# EAGLE design lda (EAGLE 8.2.2)

## Sheet 1 of 2
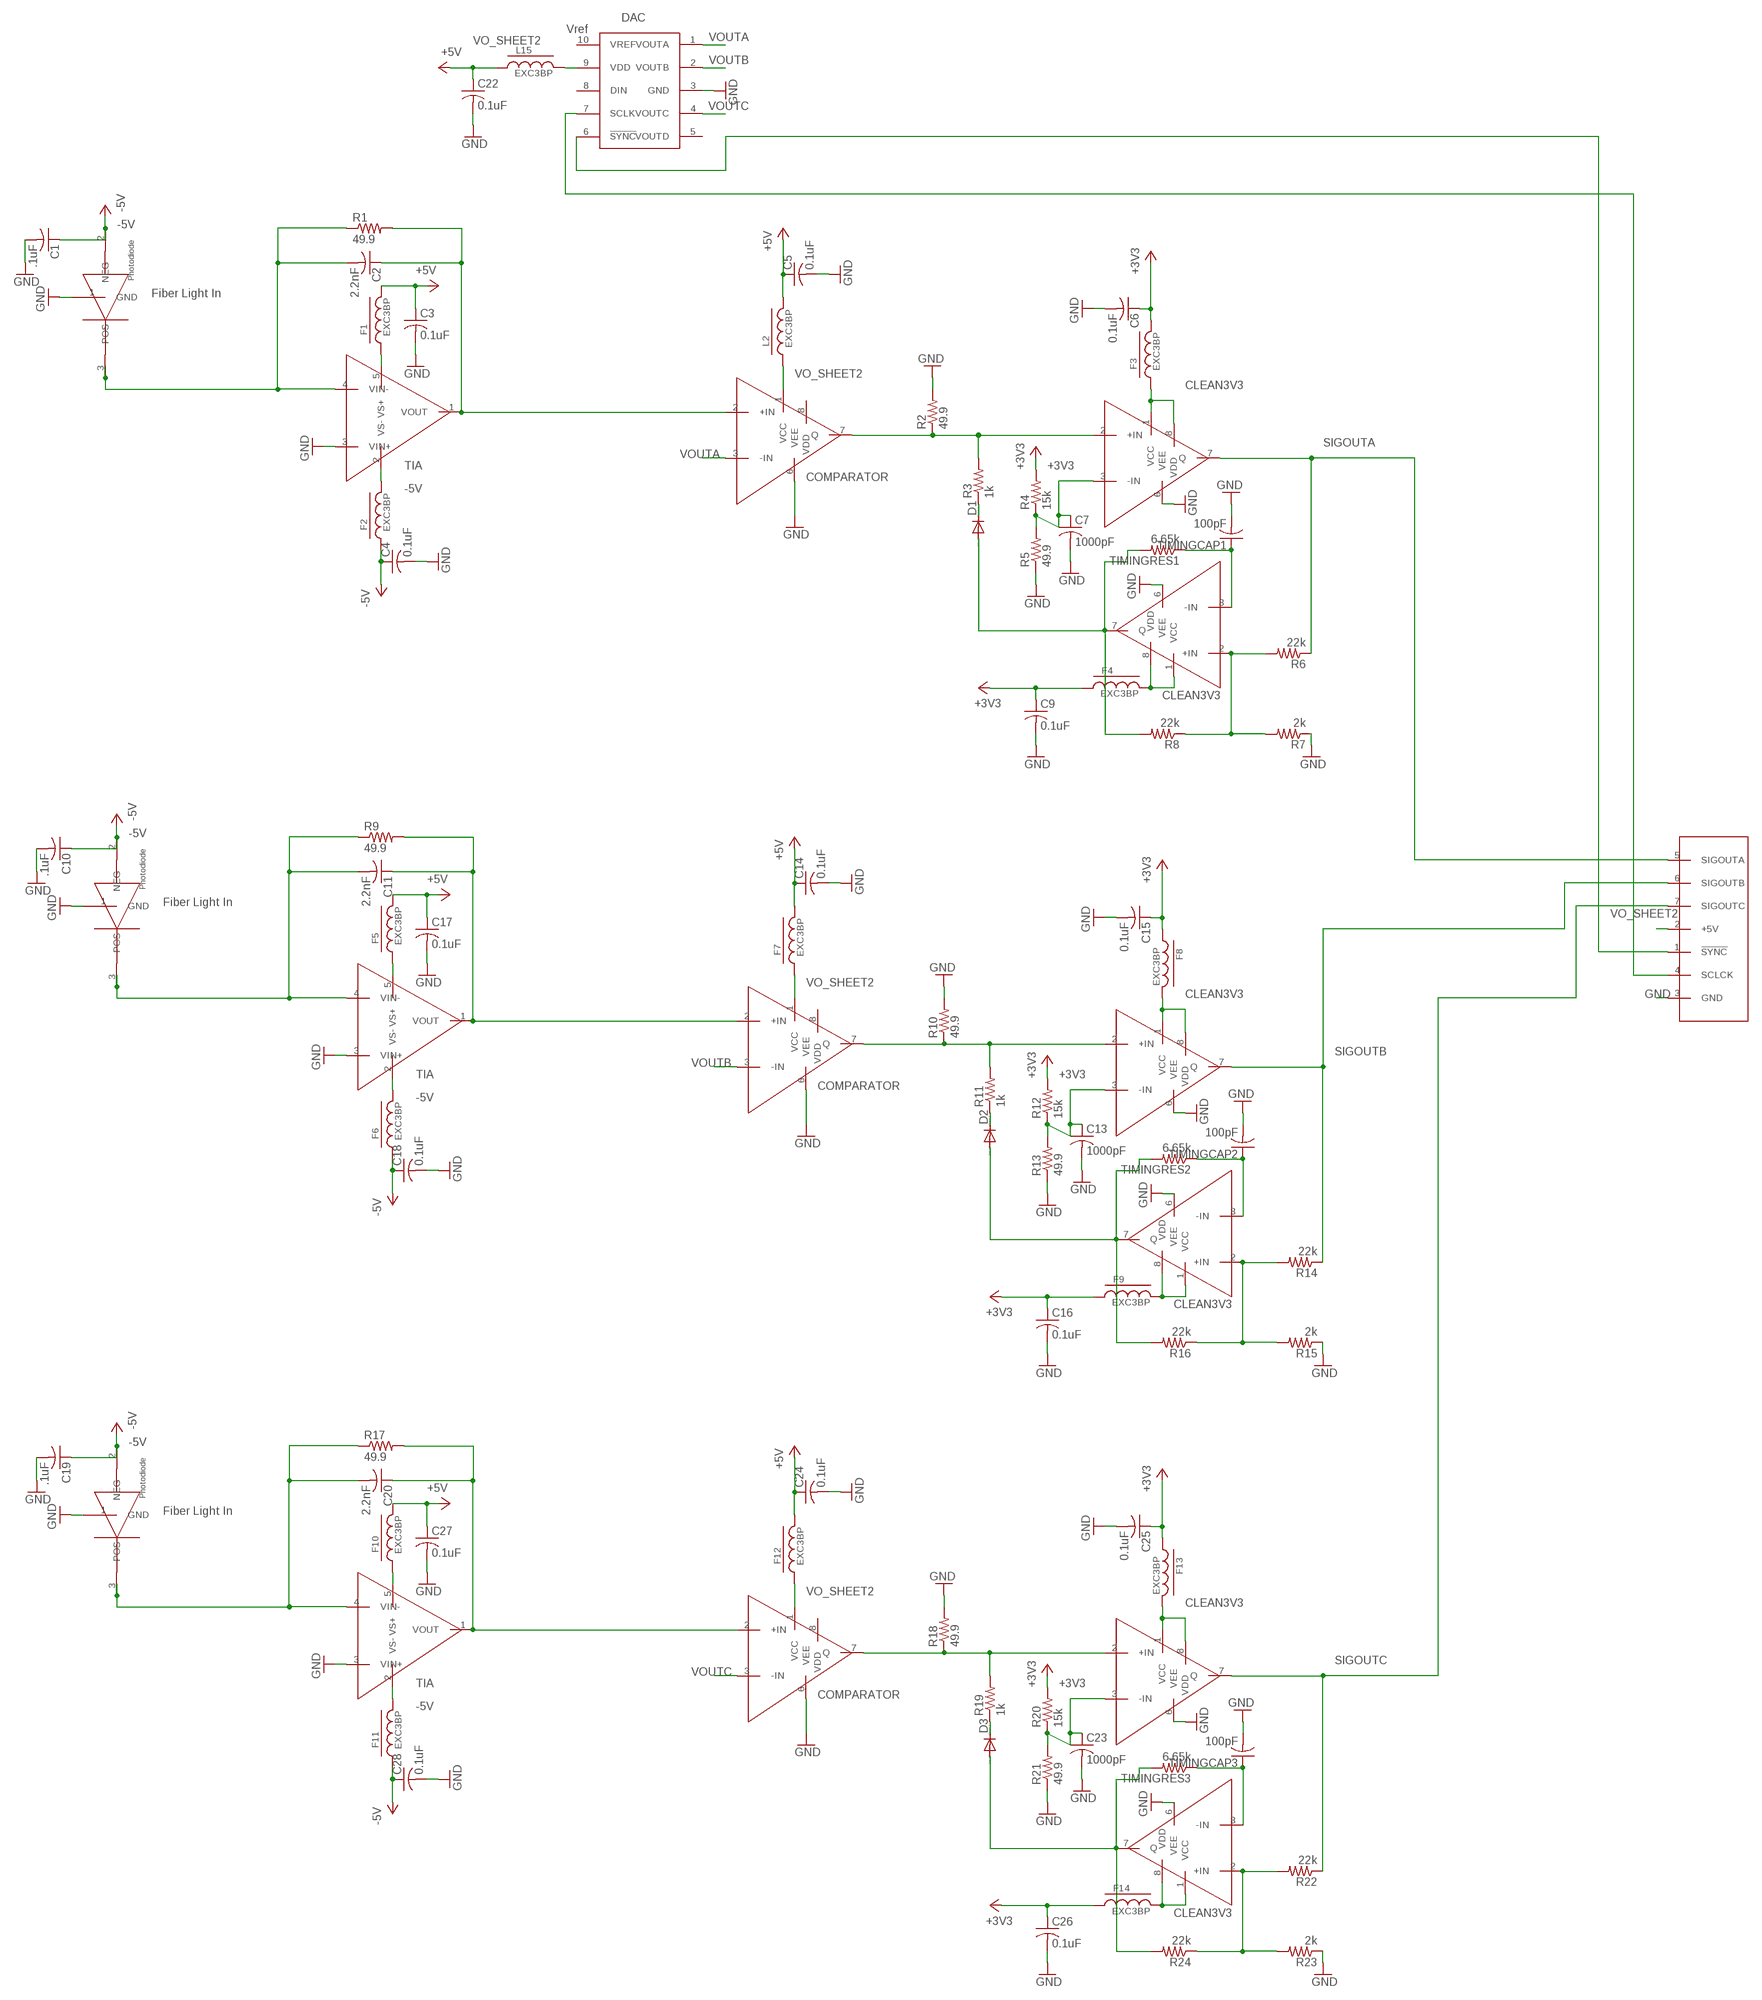
[diagram p0: schematic, sheet 1]

### Parts
C1  .1uF  C-US01005  [C01005]
C2  2.2nF  C-US01005  [C01005]
C3  0.1uF  C-US01005  [C01005]
C4  0.1uF  C-US01005  [C01005]
C5  0.1uF  C-US01005  [C01005]
C6  0.1uF  C-US01005  [C01005]
C7  1000pF  C-US01005  [C01005]
C9  0.1uF  C-US01005  [C01005]
C10  .1uF  C-US01005  [C01005]
C11  2.2nF  C-US01005  [C01005]
C13  1000pF  C-US01005  [C01005]
C14  0.1uF  C-US01005  [C01005]
C15  0.1uF  C-US01005  [C01005]
C16  0.1uF  C-US01005  [C01005]
C17  0.1uF  C-US01005  [C01005]
C18  0.1uF  C-US01005  [C01005]
C19  .1uF  C-US01005  [C01005]
C20  2.2nF  C-US01005  [C01005]
C22  0.1uF  C-US01005  [C01005]
C23  1000pF  C-US01005  [C01005]
C24  0.1uF  C-US01005  [C01005]
C25  0.1uF  C-US01005  [C01005]
C26  0.1uF  C-US01005  [C01005]
C27  0.1uF  C-US01005  [C01005]
C28  0.1uF  C-US01005  [C01005]
COMPARATOR1  LTC6752DEV  [MS8-MSOP]
COMPARATOR2  LTC6752DEV  [MS8-MSOP]
COMPARATOR3  LTC6752DEV  [MS8-MSOP]
COMPARATOR4  LTC6752DEV  [MS8-MSOP]
COMPARATOR5  LTC6752DEV  [MS8-MSOP]
COMPARATOR6  LTC6752DEV  [MS8-MSOP]
COMPARATOR7  LTC6752DEV  [MS8-MSOP]
COMPARATOR8  LTC6752DEV  [MS8-MSOP]
COMPARATOR9  LTC6752DEV  [MS8-MSOP]
D1  DIODE-SOD523  [SOD523]
D2  DIODE-SOD523  [SOD523]
D3  DIODE-SOD523  [SOD523]
DAC  AD5624DEV  [AD5624MSOP]
F1  EXC3BP  [R01005]
F2  EXC3BP  [R01005]
F3  EXC3BP  [R01005]
F4  EXC3BP  [R01005]
F5  EXC3BP  [R01005]
F6  EXC3BP  [R01005]
F7  EXC3BP  [R01005]
F8  EXC3BP  [R01005]
F9  EXC3BP  [R01005]
F10  EXC3BP  [R01005]
F11  EXC3BP  [R01005]
F12  EXC3BP  [R01005]
F13  EXC3BP  [R01005]
F14  EXC3BP  [R01005]
L2  EXC3BP  [R01005]
L15  EXC3BP  [R01005]
PD1  EPM605DEV  [PINPDBOX]
PD2  EPM605DEV  [PINPDBOX]
PD3  EPM605DEV  [PINPDBOX]
R1  49.9  R-US_01005  [R01005]
R2  49.9  R-US_01005  [R01005]
R3  1k  R-US_01005  [R01005]
R4  15k  R-US_01005  [R01005]
R5  49.9  R-US_01005  [R01005]
R6  22k  R-US_01005  [R01005]
R7  2k  R-US_01005  [R01005]
R8  22k  R-US_01005  [R01005]
R9  49.9  R-US_01005  [R01005]
R10  49.9  R-US_01005  [R01005]
R11  1k  R-US_01005  [R01005]
R12  15k  R-US_01005  [R01005]
R13  49.9  R-US_01005  [R01005]
R14  22k  R-US_01005  [R01005]
R15  2k  R-US_01005  [R01005]
R16  22k  R-US_01005  [R01005]
R17  49.9  R-US_01005  [R01005]
R18  49.9  R-US_01005  [R01005]
R19  1k  R-US_01005  [R01005]
R20  15k  R-US_01005  [R01005]
R21  49.9  R-US_01005  [R01005]
R22  22k  R-US_01005  [R01005]
R23  2k  R-US_01005  [R01005]
R24  22k  R-US_01005  [R01005]
TIA1  OPA657DEV  [OPA-SOIC]
TIA2  OPA657DEV  [OPA-SOIC]
TIA3  OPA657DEV  [OPA-SOIC]
TIMINGCAP1  100pF  C-US01005  [C01005]
TIMINGCAP2  100pF  C-US01005  [C01005]
TIMINGCAP3  100pF  C-US01005  [C01005]
TIMINGRES1  6.65k  R-US_01005  [R01005]
TIMINGRES2  6.65k  R-US_01005  [R01005]
TIMINGRES3  6.65k  R-US_01005  [R01005]
U$2  SAMTEC7PIN  [SAMTEC7PIN]

### Nets
+3V3: C6.1 C9.1 C15.1 C16.1 C25.1 C26.1 F3.2 F4.1 F8.1 F9.1 F13.1 F14.1 R4.2 R12.2 R20.2 ; also sheet 2
-5V: C1.1 C4.1 C10.1 C18.1 C19.1 C28.1 F2.1 F6.1 F11.1 PD1.2(NEG) PD2.2(NEG) PD3.2(NEG) ; also sheet 2
CLEAN3V3: COMPARATOR2.1(VCC) COMPARATOR2.8(VDD) COMPARATOR3.1(VCC) COMPARATOR3.8(VDD) COMPARATOR5.1(VCC) COMPARATOR5.8(VDD) COMPARATOR6.1(VCC) COMPARATOR6.8(VDD) COMPARATOR8.1(VCC) COMPARATOR8.8(VDD) COMPARATOR9.1(VCC) COMPARATOR9.8(VDD) F3.1 F4.2 F8.2 F9.2 F13.2 F14.2
GND: C1.2 C3.2 C4.2 C5.2 C6.2 C7.2 C9.2 C10.2 C13.2 C14.2 C15.2 C16.2 C17.2 C18.2 C19.2 C22.2 C23.2 C24.2 C25.2 C26.2 C27.2 C28.2 COMPARATOR1.6(VEE) COMPARATOR2.6(VEE) COMPARATOR3.6(VEE) COMPARATOR4.6(VEE) COMPARATOR5.6(VEE) COMPARATOR6.6(VEE) COMPARATOR7.6(VEE) COMPARATOR8.6(VEE) COMPARATOR9.6(VEE) DAC.3(GND) PD1.1(GND) PD2.1(GND) PD3.1(GND) R2.2 R5.1 R7.1 R10.2 R13.1 R15.1 R18.2 R21.1 R23.1 TIA1.3(VIN+) TIA2.3(VIN+) TIA3.3(VIN+) TIMINGCAP1.2 TIMINGCAP2.2 TIMINGCAP3.2 U$2.3(GND) ; also sheet 2
N$1: F1.1 TIA1.5(VS+)
N$2: F2.2 TIA1.2(VS-)
N$3: COMPARATOR1.1(VCC) L2.1
N$4: C2.1 COMPARATOR1.2(+IN) R1.2 TIA1.1(VOUT)
N$6: DAC.6(!SYNC) U$2.1(!SYNC)
N$8: COMPARATOR1.7(Q) COMPARATOR2.2(+IN) R2.1 R3.2
N$9: D1.C R3.1
N$11: COMPARATOR3.7(Q) D1.A R8.2 TIMINGRES1.2
N$12: DAC.9(VDD) L15.2
N$13: COMPARATOR3.3(-IN) TIMINGCAP1.1 TIMINGRES1.1
N$15: C7.1 COMPARATOR2.3(-IN) R4.1 R5.2
N$16: COMPARATOR3.2(+IN) R6.2 R7.2 R8.1
N$17: C11.1 COMPARATOR4.2(+IN) R9.2 TIA2.1(VOUT)
N$18: COMPARATOR4.7(Q) COMPARATOR6.2(+IN) R10.1 R11.2
N$19: D2.C R11.1
N$20: COMPARATOR5.7(Q) D2.A R16.2 TIMINGRES2.2
N$21: COMPARATOR5.3(-IN) TIMINGCAP2.1 TIMINGRES2.1
N$22: C13.1 COMPARATOR6.3(-IN) R12.1 R13.2
N$23: COMPARATOR5.2(+IN) R14.2 R15.2 R16.1
N$24: C11.2 PD2.3(POS) R9.1 TIA2.4(VIN-)
N$25: F5.1 TIA2.5(VS+)
N$26: F6.2 TIA2.2(VS-)
N$27: COMPARATOR4.1(VCC) F7.1
N$28: C20.1 COMPARATOR7.2(+IN) R17.2 TIA3.1(VOUT)
N$29: C2.2 PD1.3(POS) R1.1 TIA1.4(VIN-)
N$30: COMPARATOR7.7(Q) COMPARATOR9.2(+IN) R18.1 R19.2
N$31: D3.C R19.1
N$32: COMPARATOR8.7(Q) D3.A R24.2 TIMINGRES3.2
N$33: COMPARATOR8.3(-IN) TIMINGCAP3.1 TIMINGRES3.1
N$34: C23.1 COMPARATOR9.3(-IN) R20.1 R21.2
N$35: COMPARATOR8.2(+IN) R22.2 R23.2 R24.1
N$36: C20.2 PD3.3(POS) R17.1 TIA3.4(VIN-)
N$37: F10.1 TIA3.5(VS+)
N$38: F11.2 TIA3.2(VS-)
N$39: COMPARATOR7.1(VCC) F12.1
N$41: DAC.7(SCLK) U$2.4(SCLCK)
SIGOUTA: COMPARATOR2.7(Q) R6.1 U$2.5(SIGOUTA)
SIGOUTB: COMPARATOR6.7(Q) R14.1 U$2.6(SIGOUTB)
SIGOUTC: COMPARATOR9.7(Q) R22.1 U$2.7(SIGOUTC)
VO_SHEET2: C3.1 C5.1 C14.1 C17.1 C22.1 C24.1 C27.1 F1.2 F5.2 F7.2 F10.2 F12.2 L2.2 L15.1 U$2.2(+5V) ; supply symbol labelled +5V ; also sheet 2
VOUTA: COMPARATOR1.3(-IN) DAC.1(VOUTA)
VOUTB: COMPARATOR4.3(-IN) DAC.2(VOUTB)
VOUTC: COMPARATOR7.3(-IN) DAC.4(VOUTC)
Unconnected: COMPARATOR1.8(VDD) COMPARATOR4.8(VDD) COMPARATOR7.8(VDD) DAC.5(VOUTD) DAC.8(DIN) DAC.10(VREF)

### Notes on the sheet
- DAC
- Vref
- Fiber Light In
- TIA
- COMPARATOR
- Fiber Light In
- TIA
- COMPARATOR
- Fiber Light In
- TIA
- COMPARATOR

## Sheet 2 of 2
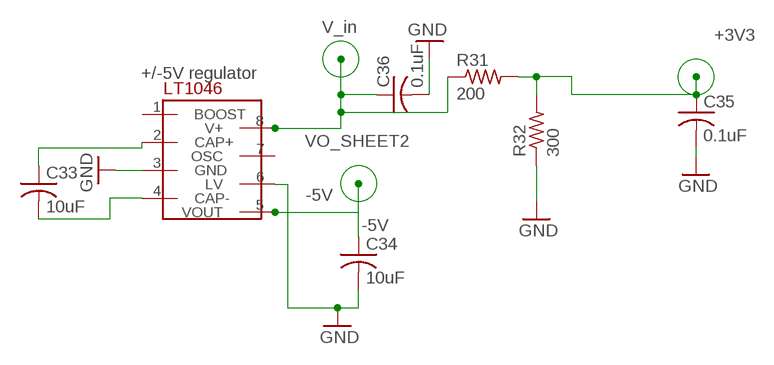
[diagram p1: schematic, sheet 2]

### Parts
C33  10uF  C-US01005  [C01005]
C34  10uF  C-US01005  [C01005]
C35  0.1uF  C-US01005  [C01005]
C36  0.1uF  C-US01005  [C01005]
R31  200  R-US_01005  [R01005]
R32  300  R-US_01005  [R01005]
U$1  LT1046REG  [S8]

### Nets
+3V3: C35.1 R31.2 R32.2 ; also sheet 1
-5V: C34.1 U$1.5(VOUT) ; also sheet 1
GND: C34.2 C35.2 C36.2 R32.1 U$1.3(GND) U$1.6(LV) ; also sheet 1
N$10: C33.2 U$1.4(CAP-)
N$40: C33.1 U$1.2(CAP+)
VO_SHEET2: C36.1 R31.1 U$1.8(V+) ; also sheet 1
Unconnected: U$1.1(BOOST) U$1.7(OSC)

### Notes on the sheet
- V_in
- +/-5V regulator
- -5V

## Library data of the parts
C1-C7 C9-C11 C13-C20 C22-C28 C33-C36 TIMINGCAP1-TIMINGCAP3 = rcl:C-US: CAPACITOR, American symbol
COMPARATOR1-COMPARATOR9 = ldalibrary:LTC6752DEV: Compartor
D1-D3 = diode:DIODE-: DIODE
DAC = ldalibrary:AD5624DEV: 4 Channel DAC
F1-F14 L2 L15 = ferrite:EXC3BP: Chip Bead Core
PD1-PD3 = ldalibrary:EPM605DEV: EPM 605
R1-R24 R31 R32 TIMINGRES1-TIMINGRES3 = rcl:R-US_: RESISTOR, American symbol
TIA1-TIA3 = ldalibrary:OPA657DEV: OPA657 TIA
U$1 = ldalibrary:LT1046REG: LT1046 Negative Regulator 5V --> -5V
U$2 = ldalibrary:SAMTEC7PIN: fpga connector to output of BIST board

## Net classes
0 default: width 0.152 mm, drill 0.3 mm, clearance 0.152 mm

## Board
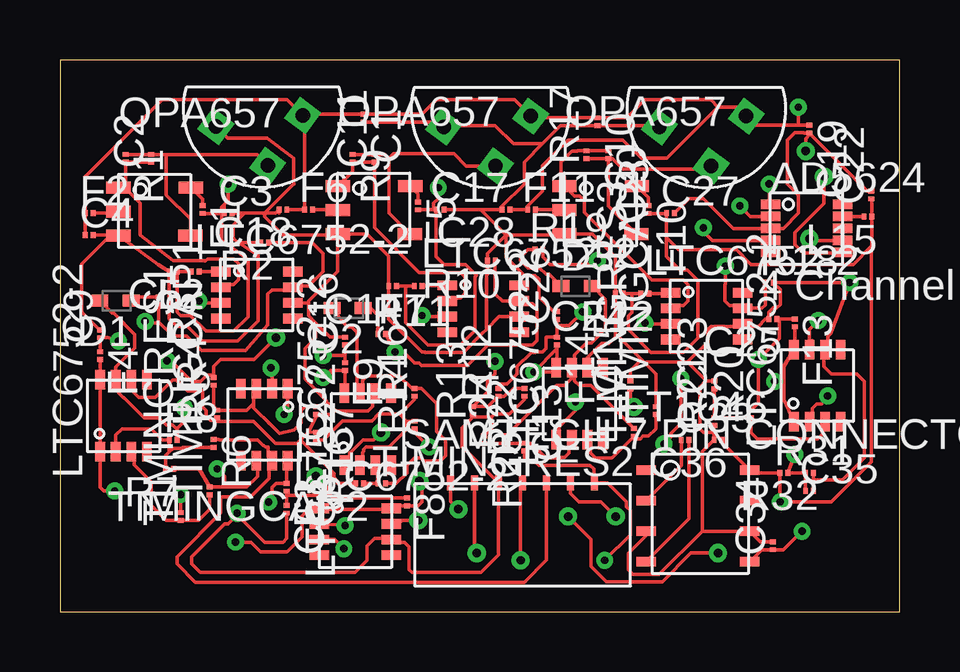
[diagram p2: board, top side]
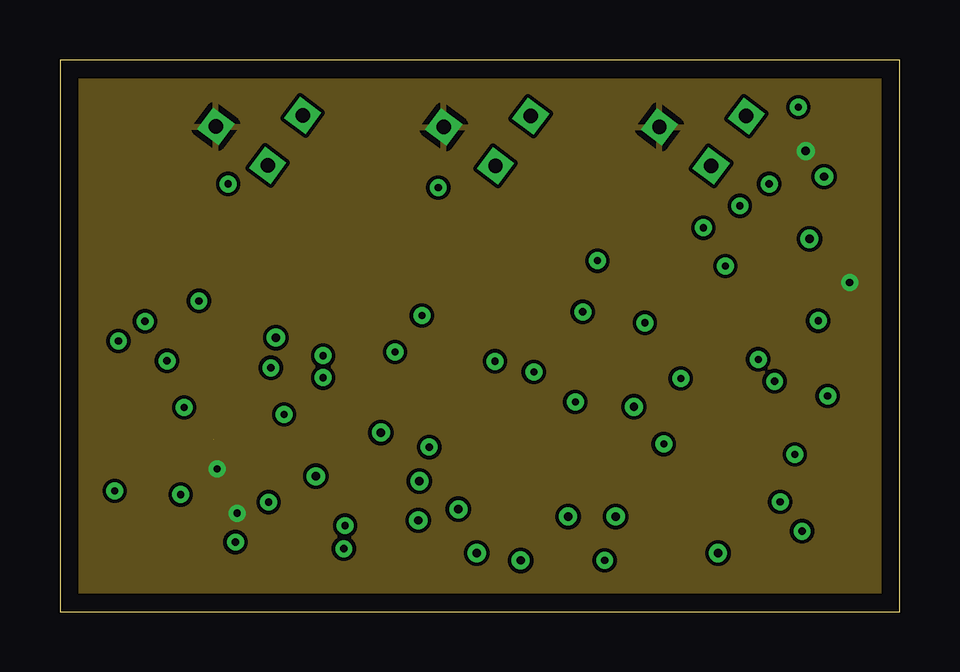
[diagram p3: board, inner layer Route2]
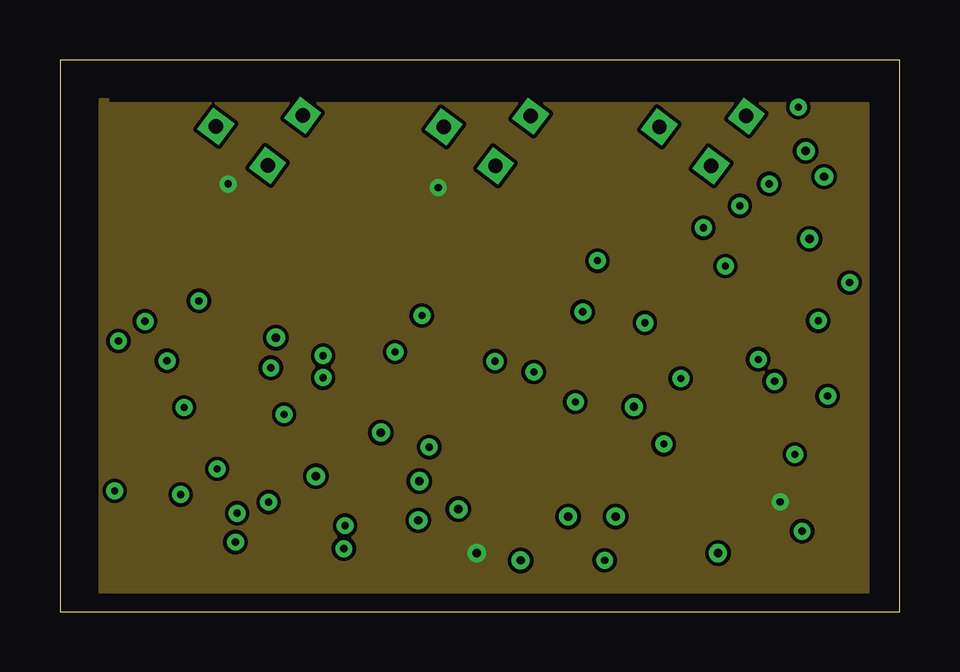
[diagram p4: board, inner layer Route3]
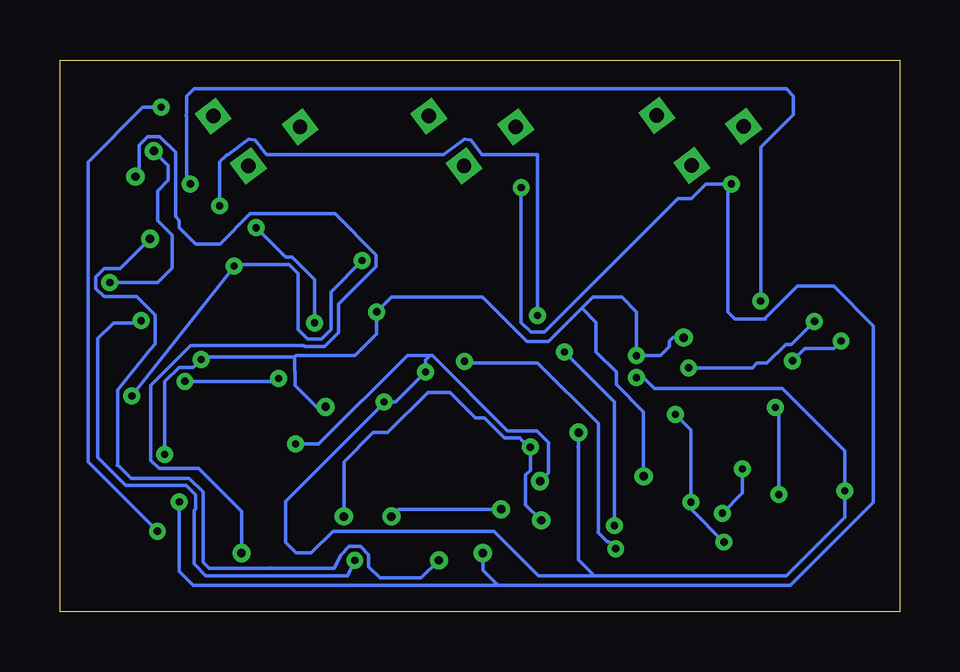
[diagram p5: board, bottom side, seen from below]

Size 35 x 23 mm. Coordinates in mm from the lower left corner, seen from the top.
Outline: 0,0 35,0 35,23 0,23 0,0
Copper layers (1*2+3*16): Top 0.035mm / dielectric 0.25mm / Route2 0.035mm / dielectric 0.5mm / Route3 0.035mm / dielectric 0.25mm / Bottom 0.035mm
Design rules "default *": minimum track width 6mil, minimum drill 0.3mm, track to track 6mil, track to pad 6mil, pad to pad 0mil, via to via 6mil, smd to smd 0mil, copper to edge 30mil, drill to drill 6mil, minimum pad ring 10mil, minimum via ring 8mil, stop-mask expansion 4mil, vias tented up to drill 0mil, thermal gap 10mil

### Footprints (pad centres in the part's own frame; a part is rotated, then mirrored left to right if it is on the bottom)
C01005 = smd 0.2 x 0.25: 1 -0.163,0; 2 0.163,0
MS8-MSOP = smd 0.813 x 0.406: 1 0,2.475; 2 0,1.825; 3 0,1.175; 4 0,0.525; 5 3,0.525; 6 3,1.175; 7 3,1.825; 8 3,2.475
SOD523 = smd 0.7 x 0.5: A 0.7,0; C -0.6,0
AD5624MSOP = smd 0.813 x 0.406: 1 0,2.5; 2 0,2; 3 0,1.5; 4 0,1; 5 0,0.5; 6 3,0.5; 7 3,1; 8 3,1.5; 9 3,2; 10 3,2.5
R01005 = smd 0.2 x 0.25: 1 -0.163,0; 2 0.163,0
PINPDBOX = drill 0.6 square: 1 1.73,1; 2 -0.89,-1.54; 3 -0.97,1
OPA-SOIC = smd 1.016 x 0.508: 1 0,2.5; 2 0,1.5; 3 0,0.5; 4 3,0.5; 5 3.02,2.5
S8 = smd 0.813 x 0.406: 1 -0.254,4.318; 2 -0.254,3.048; 3 -0.254,1.778; 4 -0.254,0.508; 5 4.064,0.508; 6 4.064,1.778; 7 4.064,3.048; 8 4.064,4.318
SAMTEC7PIN = smd 0.305 x 0.61: 1 1.5,4.3; 2 2.5,4.3; 3 3.5,4.3; 4 4.5,4.3; 5 5.5,4.3; 6 6.5,4.3; 7 7.5,4.3

### Placement (x,y rotation side)
C1  12.65,20.57 270 top
C2  3.81,18.9 90 top
C3  7.01,16.61 0 top
C4  1.22,15.7 0 top
C5  4.72,14.17 180 top
C6  9.45,4.27 270 top
C7  10.67,8.38 270 top
C9  1.68,11.58 90 top
C10  22.4,20.42 270 top
C11  13.11,18.9 90 top
C13  19.35,9.14 270 top
C14  13.87,13.56 180 top
C15  23.77,9.45 90 top
C16  11.89,11.28 90 top
C17  15.85,16.76 0 top
C18  9.3,16.76 180 top
C19  31.24,20.12 270 top
C20  22.86,19.05 270 top
C22  33.83,17.37 90 top
C23  27.28,9.45 90 top
C24  23.32,13.26 180 top
C25  29.72,12.19 180 top
C26  20.73,12.34 90 top
C27  25.45,16.61 0 top
C28  18.59,16.76 180 top
C33  26.06,7.16 0 top
C34  29.72,2.74 90 top
C35  31.24,5.03 0 top
C36  27.43,7.16 180 top
COMPARATOR1  6.7,11.7 0 top
COMPARATOR2  7.02,9.3 270 top
COMPARATOR3  4.15,6.66 90 top
COMPARATOR4  16.15,11.13 0 top
COMPARATOR5  14.33,6.1 90 top
COMPARATOR6  10.82,1.83 0 top
COMPARATOR7  25.45,10.82 0 top
COMPARATOR8  23.16,7.16 90 top
COMPARATOR9  33.07,7.92 90 top
D1  2.36,12.96 180 top
D2  12.04,12.65 180 top
D3  21.49,13.56 0 top
DAC  29.62,14.48 0 top
F1  5.94,16.76 270 top
F2  1.22,16.61 0 top
F3  9.45,5.18 270 top
F4  1.68,10.67 270 top
F5  14.94,16.92 270 top
F6  10.36,16.76 0 top
F7  14.94,13.56 180 top
F8  14.48,4.57 270 top
F9  11.89,10.21 270 top
F10  24.54,16.76 270 top
F11  19.66,16.76 0 top
F12  24.38,13.26 180 top
F13  30.63,12.04 270 top
F14  20.73,11.28 270 top
L2  5.64,14.17 180 top
L15  33.68,16.46 180 top
PD1  8.48,19.99 143.2 top
PD2  17.98,19.96 143 top
PD3  26.97,19.96 143 top
R1  2.74,18.9 270 top
R2  8.53,15.39 180 top
R3  4.11,12.95 270 top
R4  6.4,9.6 90 top
R5  6.55,8.23 90 top
R6  6.4,7.01 270 top
R7  4.57,5.94 180 top
R8  4.72,7.16 0 top
R9  12.19,18.9 270 top
R10  17.98,14.63 180 top
R11  13.41,11.58 0 top
R12  18.29,9.14 90 top
R13  17.22,8.38 90 top
R14  14.78,7.77 90 top
R15  10.67,7.32 270 top
R16  14.78,9.14 90 top
R17  21.95,19.05 90 top
R18  29.57,13.72 0 top
R19  19.96,15.09 0 top
R20  28.8,8.23 90 top
R21  27.28,7.92 90 top
R22  19.35,6.86 90 top
R23  17.68,7.16 270 top
R24  18.59,7.16 90 top
R31  30.18,5.79 0 top
R32  31.24,5.79 180 top
TIA1  2.44,15.18 0 top
TIA2  11.58,15.24 0 top
TIA3  21.03,15.24 0 top
TIMINGCAP1  6.25,5.03 90 top
TIMINGCAP2  12.5,5.33 180 top
TIMINGCAP3  24.84,8.38 90 top
TIMINGRES1  5.03,3.96 90 top
TIMINGRES2  13.41,5.33 0 top
TIMINGRES3  23.93,7.47 90 top
U$1  24.69,1.57 0 top
U$2  14.78,1.07 0 top

### Tracks (layer width: path | path; a pad name or v marks a point on that pad's centre or on a via)
+3V3  (via drill 0.3, 0.35)
  Top 0.152: 9.45,4.82 F3.2 | 9.45,4.82 C6.1 | F4.1 C9.1 1.99,11.42 v2.44,11.28 | 11.89,10.69 F9.1 | 11.89,10.69 C16.1 | C26.1 20.73,11.93 | 20.73,11.93 F14.1 20.28,11.44 20.27,11.43 20.27,10.97 20.12,10.82 19.83,10.82 19.82,10.81 19.65,10.81 19.05,10.21 19.05,9.91 18.64,9.49 18.29,9.49 R12.2 | 30.02,12.2 F13.1 | 30.02,12.2 29.89,12.2 C25.1 | 31.03,5.79 R32.2 | 31.03,5.79 R31.2 v30.63,6.55 | C35.1 31.08,5.74 31.03,5.79 | v4.46,10.46 4.63,10.46 5.49,9.6 5.87,9.6 6.14,9.87 6.4,9.87 R4.2 6.41,10.22 6.71,10.52 8.1,10.52 v9,11.42 | v10.97,10.67 11.86,10.67 11.89,10.69 | 30.02,12.2 29.99,12.14 29.99,11.39 v29.11,10.52 29.11,8.7 R20.2 | 20.73,11.93 21.23,11.93 v21.79,12.5 | 11.28,4.84 11.28,5.03 v10.67,5.64 | 9.45,4.82 9.46,4.84 11.28,4.84 | F8.1 11.38,4.73 11.28,4.84 | C15.1 23.77,8.69 v23.93,8.53
  Bottom 0.152: v4.46,10.46 3.94,10.97 2.74,10.97 v2.44,11.28 | v10.67,5.64 10.67,8.33 11.81,9.47 11.81,9.98 12.65,10.82 12.65,12.06 13.24,12.65 | 13.24,12.65 14.64,11.26 15.54,11.26 17.39,13.11 21.18,13.11 v21.79,12.5 21.79,11.58 22.71,10.67 25.16,10.67 25.21,10.62 | 13.24,12.65 12.78,13.11 11.58,13.11 10.97,12.5 v10.97,10.67 9.98,10.67 9.6,11.04 9.6,11.28 9.46,11.42 v9,11.42 | 25.21,10.62 25.21,10.02 25.2,10.01 25.2,9.44 25.2,9.43 24.31,8.53 v23.93,8.53 | 25.21,10.62 29.01,10.62 v29.11,10.52 29.44,10.18 30.03,10.18 30.63,9.58 v30.63,6.55
-5V  (via drill 0.3)
  Top 0.152: C19.1 30.79,20.28 | 30.79,20.28 28.99,20.28 PD3.2 28.24,21.03 27.43,21.03 | C4.1 F2.1 1.06,18.12 4.27,21.34 9.47,21.34 PD1.2 | C18.1 F6.1 10.2,20.61 PD1.2 | C28.1 F11.1 19.5,16.91 20.12,17.53 20.12,18.59 21.18,19.66 23.47,19.66 24.23,18.9 25.3,18.9 27.43,21.03 | PD1.2 10.16,20.74 C1.1 15.1,20.74 15.7,21.34 18.94,21.34 PD2.2 19.7,20.58 C10.1 23.63,20.58 24.38,21.34 27.13,21.34 27.43,21.03 | U$1.5 29.25,2.58 C34.1 30.16,2.58 v30.94,3.35 | 30.79,20.28 v30.79,21.03
  Bottom 0.152: v30.94,3.35 33.83,6.25 33.83,18.75 31.55,21.03 v30.79,21.03
CLEAN3V3  (via drill 0.3, 0.35)
  Top 0.152: COMPARATOR2.8 9.45,6.25 F3.1 9,5.34 8.84,5.18 8.84,4.82 8.7,4.68 | 13.86,4.27 COMPARATOR6.8 | F13.2 30.63,10.96 COMPARATOR9.8 30.18,10.21 30.18,9.45 | 13.86,4.27 10.86,4.27 COMPARATOR6.1 10.7,4.19 10.28,4.19 10.08,3.99 10.08,3.11 9.46,2.49 8.37,2.49 7.96,2.9 v7.32,2.9 | 30.18,9.45 30.18,8.84 COMPARATOR9.1 | 8.7,4.68 v8.7,4.56 | 8.7,4.68 8.7,4.73 | 30.18,9.45 29.94,9.45 v29.79,9.6 | v25.17,6.98 25.47,7.28 25.47,7.42 25.88,7.84 v25.88,9.72 | COMPARATOR2.1 9.49,8.36 v9.35,8.22 | 13.86,4.27 14,4.41 F8.2 14.93,4.41 15.09,4.57 15.09,5.33 v14.98,5.44 | COMPARATOR8.1 20.81,7.28 20.81,7.71 21.48,8.38 v21.48,8.74 | COMPARATOR5.8 11.89,9.13 F9.2 11.28,10.05 11.01,9.78 | F4.2 COMPARATOR3.8 COMPARATOR3.1 1.68,5.18 1.83,5.03 v2.29,5.03 | 11.01,9.78 11.42,10.05 | 11.01,9.78 v10.97,9.75 | v13.38,7.46 13.08,7.16 12.63,7.16 12.11,6.64 | 12.07,6.61 12.11,6.64 | 12.11,6.64 12.11,6.63 12.07,6.6 12.07,6.31 COMPARATOR5.1 | 20.73,10.2 COMPARATOR8.8 20.52,9.99 v19.75,9.99 20.73,10.96 F14.2 20.73,10.2
  Bottom 0.152: v7.32,2.9 8.7,4.28 v8.7,4.56 8.7,7.57 v9.35,8.22 | v29.79,9.6 26,9.6 v25.88,9.72 | v25.17,6.98 24.21,6.98 20.52,10.67 19.57,10.67 | 19.57,10.67 19.47,10.67 16.34,7.54 15.11,7.54 14.6,7.04 14.63,7.01 14.63,5.79 v14.98,5.44 | 21.44,8.74 v21.48,8.74 | 21.44,8.74 21,8.74 v19.75,9.99 19.75,10.48 19.57,10.67 | 21.44,8.74 25.6,4.58 25.6,2.9 25.15,2.44 24.54,2.44 23.62,3.35 16.92,3.35 15.06,1.5 12.8,1.5 | 12.65,1.5 12.8,1.5 | v10.97,9.75 10.67,9.75 10.21,9.3 4.88,9.3 2.29,6.71 v2.29,5.03 2.29,3.93 4.71,1.5 12.73,1.5 12.85,1.62 | 13.41,6.86 13.38,6.89 v13.38,7.46 13.38,2.15 12.85,1.62 | 12.8,1.5 12.8,1.57 12.85,1.62
GND  (via drill 0.3, 0.35)
  Top 0.152: C22.2 33.66,17.54 C19.2 | C19.2 31.28,19.92 31.09,19.73 v31.09,19.2 | 2.11,15.7 C4.2 | 2.11,15.7 2.42,15.7 TIA1.3 4.1,14.48 C5.2 4.56,12.2 4.88,11.89 5.32,11.89 5.92,11.28 7.42,11.28 8.25,12.12 8.25,14.85 7.32,15.47 | C34.2 29.2,2.91 U$1.6 26.78,3.35 | C35.2 31.4,5.49 | 31.4,5.49 R32.1 | U$1.3 24.43,3.16 23.7,2.42 23.7,1.74 23.89,1.55 24.98,1.55 26.78,3.35 | C1.2 15.79,20.41 PD2.1 16.06,20.27 18.14,20.27 18.9,19.51 20.12,19.51 | PD3.1 24.94,20.26 C10.2 20.87,20.26 20.12,19.51 | 20.12,19.51 19.36,18.75 19.36,17.83 18.43,16.91 C28.2 17.53,16.76 | 7.7,16.61 8.52,16.61 | 7.7,16.61 C3.2 | 8.52,16.61 8.98,16.61 C18.2 9.13,16.62 | PD1.1 7,19.73 8.64,19.73 9.74,18.9 9.74,17.84 9.75,17.83 9.74,17.83 8.52,16.61 | 11.51,15.7 11.54,15.7 TIA2.3 12.79,15.74 13.71,14.83 C14.2 13.71,12.2 15.09,10.82 15.21,10.82 15.22,10.81 16.82,10.81 17.6,11.59 17.78,11.77 | C17.2 17.53,16.76 | 18.59,15.7 17.53,16.76 | 18.59,15.7 20.99,15.7 TIA3.3 22.19,15.74 23.16,14.78 23.16,14.77 C24.2 23.16,11.59 | 7.32,15.47 7.21,15.59 7.21,16.12 7.7,16.61 | R2.2 7.41,15.39 7.32,15.47 | 17.78,11.77 17.78,14.02 17.82,14.06 R10.2 17.82,14.93 18.55,15.65 | 18.55,15.65 18.59,15.7 | 24.23,10.52 23.16,11.59 | 26.16,10.41 27,11.24 27,11.76 27.13,11.89 28.34,11.89 COMPARATOR7.6 28.56,11.89 29.11,11.89 29.41,12.19 C25.2 29.55,12.49 29.72,12.65 29.87,12.65 30.02,12.8 30.02,13.42 R18.2 v32.92,13.72 32.14,11.6 32.01,11.47 32.01,11.24 31.92,11 31.9,10.94 | C26.2 20.56,12.51 19.96,13.11 19.96,13.87 19.81,14.02 19.36,14.02 18.59,14.78 18.59,15.61 18.55,15.65 | 23.16,11.59 23.16,11.46 22.88,11.18 22.58,11.18 21.99,10.59 COMPARATOR8.6
  Top 0.152: COMPARATOR5.6 13.03,8.98 13.03,8.55 12.84,8.36 11.51,8.36 11.48,8.39 | 9.82,12.76 COMPARATOR1.6 10.29,12.87 10.36,12.8 | C16.2 11.26,11.44 10.66,12.04 | C9.2 1.67,11.74 0.91,12.5 0.91,14.5 2.11,15.7 | 10.66,12.04 10.66,11.43 10.21,10.97 10.21,9.69 11.12,8.78 11.12,8.75 11.48,8.39 | 11.48,8.39 11.31,8.22 C7.2 10.67,8.13 10.36,7.48 | 10.36,7.48 R15.1 | 2.86,9.55 COMPARATOR3.6 3.09,9.55 3.09,9.12 3.29,8.93 3.97,8.93 4.7,9.66 4.85,9.66 5.32,9.2 5.95,9.2 5.95,8.53 6.1,8.38 | 6.1,8.38 | R7.1 5.8,5.94 TIMINGCAP1.2 6.86,5.19 | 6.55,7.96 6.29,7.96 6.1,8.15 6.1,8.38 | 6.86,5.19 7.78,5.19 8.23,5.64 8.23,6.26 COMPARATOR2.6 | 6.86,5.19 6.86,5.64 v6.55,5.94 | 31.4,5.49 32.61,5.49 33.53,6.4 33.53,9.6 33.22,9.91 32.16,9.91 31.85,10.21 31.85,10.89 31.9,10.94 | 31.9,10.94 COMPARATOR9.6 | C13.2 19.36,8.84 18.75,8.23 18.11,8.23 18,8.11 | 17.22,8.11 18,8.11 | R13.1 17.22,8.11 | 18,8.11 18,7.64 R23.1 | 17.22,8.11 16.76,7.66 16.76,6.86 16.79,6.86 U$2.3 18.28,2.37 17.54,1.63 14.68,1.63 14.56,1.75 14.56,2.69 14.36,2.89 13.94,2.89 COMPARATOR6.6 13.78,3.05 13.11,3.05 12.8,2.74 12.8,2.13 12.29,1.63 5.84,1.63 5.49,1.98 5.49,2.29 6.86,3.66 7.01,3.66 7.39,4.04 | C23.2 26.96,9.61 26.93,9.63 | 26.93,9.63 26.16,10.41 | 26.78,3.35 26.78,6.67 C36.2 27.27,7.47 | 27.27,7.47 R21.1 | 27.27,7.47 26.82,7.47 26.67,7.62 26.67,9.37 26.93,9.63 | 7.39,4.04 v7.39,4.1 | 7.39,4.04 8.53,2.9 9.3,2.9 9.45,3.05 C6.2 | 6.55,7.96 6.55,7.92 8.08,7.92 8.53,7.47 8.57,7.44 8.99,7.01 9.89,7.01 10.03,7.15 | 10.03,7.15 10.36,7.48 | R5.1 6.55,7.96 | 10.36,12.8 10.36,12.34 10.66,12.04 | 10.36,12.8 10.36,12.95 11.58,14.17 11.58,15.63 11.51,15.7
  Top 0.152: 17.78,11.77 18.31,12.3 COMPARATOR4.6 | TIMINGCAP2.2 11.58,5.33 11.58,5.43 11.42,5.59 11.42,5.76 10.03,7.15 | C15.2 23.77,10.06 24.23,10.52 | TIMINGCAP3.2 24.84,9.91 24.39,10.36 | 24.39,10.36 24.23,10.52 | 26.16,10.41 24.44,10.41 24.39,10.36 | 31.02,19.95 | C27.2 26.21,17.21 26.21,17.22 26.82,17.22 28.07,15.98 DAC.3 30.15,15.98 30.79,16.61 30.79,17.37 30.33,17.83 30.33,19.66 30.63,19.96 31.01,19.96 31.02,19.95 | C19.2 31.02,19.95 | 8.52,16.61 8.52,16.47 9.3,15.7 11.51,15.7
  Bottom 0.152: v7.39,4.1 6.55,4.94 v6.55,5.94 | v32.92,13.72 30.94,13.72 30.33,14.33 30.33,15.7 30.94,16.31 30.94,17.53 30.48,17.98 30.48,18.59 v31.09,19.2
  pour Route2: -0.15,23.16 -0.46,23.16 -0.46,-1.07 35.2,-1.07 35.2,23.16
N$1
  Top 0.152: F1.1 5.94,17.19 TIA1.5
N$2
  Top 0.152: F2.2 2.37,16.61 TIA1.2
N$3
  Top 0.152: COMPARATOR1.1 L2.1
N$4
  Top 0.152: 2.57,17.81 2.74,17.98 R1.2 C2.1 | 2.57,17.81 TIA1.1 | COMPARATOR1.2 6.82,13.64 7.25,13.64 7.44,13.83 7.44,14.51 7.25,14.71 6.16,14.71 6.06,14.61 6.04,14.63 4.73,14.63 3.35,15.7 3.35,17.03 2.57,17.81
N$6  (via drill 0.35)
  Top 0.152: U$2.1 16.28,4.6 v16.61,4.27 | v27.43,2.44 26.3,2.44 25.1,1.25 22.77,1.25 22.13,1.89 22.13,3.02 v21.18,3.96 | v31.85,18.14 31.85,17.01 30.64,15.8 30.64,15.29 30.99,14.94 32.44,14.94 32.48,14.98 DAC.6
  Bottom 0.152: v16.61,4.27 20.88,4.27 v21.18,3.96 | v27.43,2.44 27.43,4.18 29.23,5.97 30.87,5.97 31.21,6.31 31.21,9.43 29.55,11.1 24.84,11.1 24.79,11.05 23.98,11.05 23.4,11.63 23.4,12.81 21.82,14.39 21.82,14.87 23.53,16.58 27.06,16.58 28.33,15.32 29.34,15.32 30.02,16 30.02,16.31 30.18,16.46 30.18,19.15 30.84,19.81 31.34,19.81 31.7,19.45 31.7,18.29 v31.85,18.14
N$8  (via drill 0.3)
  Top 0.152: 4.11,12.04 3.61,12.04 v3.55,12.1 | COMPARATOR2.2 8.84,10.12 v8.79,10.16 | R3.2 4.12,12.04 4.11,12.04 | 4.11,12.04 4.15,12.04 4.71,11.48 5.28,11.48 5.33,11.43 5.34,11.43 5.79,10.98 5.8,10.98 5.9,10.88 7.74,10.88 8.66,11.95 8.66,13.23 8.84,13.41 9.51,13.41 9.66,13.56 COMPARATOR1.7 9.74,13.56 10.36,13.56 10.97,14.17 10.97,14.94 10.52,15.39 R2.1
  Bottom 0.152: v8.79,10.16 6.14,10.16 5.94,10.36 5.52,10.36 4.74,11.14 4.51,11.14 v3.55,12.1
N$9
  Top 0.152: R3.1 3.12,13.12 D1.C
N$10
  Top 0.152: C33.2 26.22,3.87 U$1.4
N$11  (via drill 0.3)
  Top 0.152: D1.A 2.17,12.45 2.23,12.45 3.12,11.56 3.12,10.99 2.33,10.2 COMPARATOR3.7 2.44,9.55 2.44,9.12 2.64,8.93 2.65,8.93 3.5,8.08 4.12,8.08 4.42,7.77 4.7,7.77 4.89,7.59 | TIMINGRES1.2 v5.03,4.88 | v5.18,8.51 5.18,7.92 4.89,7.63 4.89,7.59 | 4.89,7.59 R8.2
  Bottom 0.152: v5.03,4.88 5.03,8.36 v5.18,8.51
N$12
  Top 0.152: L15.2 32.63,16.46 DAC.9
N$13
  Top 0.152: COMPARATOR3.3 3.09,6.55 3.09,6.12 3.81,5.4 3.81,4.42 4.43,3.8 TIMINGRES1.1 5.78,3.8 5.99,4.01 | TIMINGCAP1.1 6.25,4.27 5.99,4.01 | 5.99,4.01 5.94,3.96
N$15
  Top 0.152: R4.1 6.4,8.54 R5.2 | R5.2 6.72,8.39 | COMPARATOR2.3 8.07,9.18 8.08,9.18 8.08,8.69 | 8.82,7.76 9.16,7.42 9.75,7.57 10.06,7.87 10.06,8.38 10.22,8.54 C7.1 | 8.82,7.76 8.7,7.87 | R5.2 7.78,8.39 8.08,8.69 | 8.08,8.69 8.08,8.5 8.82,7.76
N$16
  Top 0.152: COMPARATOR3.2 2.33,7.36 2.59,7.62 3.81,7.62 4.27,7.16 R8.1 4.56,6.66 | 4.56,6.66 4.56,6.65 4.72,6.81 5.08,6.81 5.12,6.85 R6.2 | R7.2 4.41,6.51 4.56,6.66
N$17
  Top 0.152: TIA2.1 12.19,18.35 R9.2 C11.1 13.11,16 14.97,14.13 16.7,14.13 16.89,13.94 16.89,13.26 16.7,13.07 16.27,13.07 COMPARATOR4.2
N$18  (via drill 0.3)
  Top 0.152: R10.1 18.15,13.25 18.44,12.95 COMPARATOR4.7 19.27,12.83 19.7,12.83 19.89,12.64 19.89,11.31 19.7,11.12 17.85,11.12 16.99,10.26 15.07,10.26 14.97,10.36 14.78,10.36 14.33,10.82 v13.97,10.82 R11.2 | COMPARATOR6.2 v11.89,3.58
  Bottom 0.152: v11.89,3.58 11.89,8.73 v13.97,10.82
N$19
  Top 0.152: D2.C 12.95,12.65 13.26,12.34 13.26,11.82 13.24,11.8 | 13.24,11.8 R11.1 | R11.1 13.25,11.8 13.24,11.8
N$20
  Top 0.152: D2.A 11.97,11.87 12.15,11.87 12.38,11.63 12.38,9.21 COMPARATOR5.7 12.62,9.21 12.62,9.64 12.81,9.83 14.14,9.83 14.67,9.31 R16.2 15.08,9.31 15.7,8.69 15.7,7.52 16.08,7.14 16.08,6.49 15.86,6.28 15.15,6.28 15.03,6.4 14.78,6.4 14.48,6.1 14.48,5.79 14.02,5.33 TIMINGRES2.2
N$21
  Top 0.152: COMPARATOR5.3 13.25,6 TIMINGRES2.1 TIMINGCAP2.1
N$22  (via drill 0.3)
  Top 0.152: COMPARATOR6.3 11.45,3 v11.83,2.62 | v18.14,10.43 18.14,9.91 17.83,9.61 17.83,9.16 R13.2 17.85,8.54 R12.1 18.51,8.98 18.67,9.14 18.75,9.14 18.91,9.31 C13.1
  Bottom 0.152: 12.56,3.29 12.17,2.9 12.11,2.9 v11.83,2.62 | 12.56,3.29 12.57,3.3 | 18.03,10.54 v18.14,10.43 18.07,10.36 15.09,10.36 12.56,7.83 12.56,5.33 | 12.56,3.29 12.56,5.33 | 12.56,5.33 12.56,5.42
N$23
  Top 0.152: R16.1 14.78,8.84 14.17,8.23 14.15,8.23 | 14.15,8.23 13.29,8.23 13.01,7.95 11.79,7.95 10.99,7.15 R15.2 | COMPARATOR5.2 12.62,6.21 12.62,6.64 12.65,6.67 12.65,6.75 12.75,6.86 13.72,6.86 14.43,7.57 14.43,7.8 14.44,7.82 14.44,7.93 | R14.2 14.44,7.93 | 14.44,7.93 14.15,8.23
N$24
  Top 0.152: R9.1 C11.2 13.55,19.06 13.72,18.9 | 13.72,18.9 13.72,16.61 TIA2.4 | PD2.3 16.93,18.58 16.42,19.09 13.9,19.09 13.72,18.9
N$25
  Top 0.152: F5.1 14.94,17.41 TIA2.5
N$26
  Top 0.152: F6.2 11.56,16.76 TIA2.2
N$27
  Top 0.152: 15.13,13.6 F7.1 | COMPARATOR4.1 15.13,13.6 | F7.1 15.13,13.6
N$28
  Top 0.152: C20.1 R17.2 21.58,19.21 21.57,19.2 21.34,19.2 20.88,18.75 20.88,18.29 21.03,18.14 TIA3.1 21.45,17.32 21.68,17.32 21.87,17.13 21.87,16.64 24.68,13.83 25.99,13.83 26.19,13.63 26.19,12.96 25.99,12.76 25.57,12.76 COMPARATOR7.2
N$29
  Top 0.152: R1.1 C2.2 4.38,19.06 | 4.38,19.06 8.21,19.06 PD1.3 | TIA1.4 5.44,16.36 4.42,17.37 4.42,19.03 4.38,19.06
N$30  (via drill 0.3)
  Top 0.152: R18.1 29.4,12.79 29.26,12.65 COMPARATOR7.7 | COMPARATOR7.7 | v27.74,14.4 27.74,13.66 27.71,13.63 27.71,12.96 27.91,12.76 28.34,12.76 COMPARATOR7.7 | R19.2 20.13,14.77 20.42,14.48 22.25,14.48 v22.4,14.63 | COMPARATOR9.2 31.36,8.09 31.36,8.47 31.56,8.66 31.77,8.66 v32,8.99
  Bottom 0.152: v22.4,14.63 23.7,13.33 23.7,11.76 24.1,11.36 24.67,11.36 25.07,11.76 25.07,14.1 25.45,14.48 27.66,14.48 27.73,14.42 | 27.73,14.42 v27.74,14.4 | v32,8.99 27.73,14.42
N$31
  Top 0.152: R19.1 19.51,15.09 19.2,14.78 19.2,14.63 19.51,14.33 20,14.33 20.25,14.07 20.38,14.07 D3.C
N$32
  Top 0.152: D3.A 22.72,13.03 22.72,13 22.75,12.97 22.75,11.79 22.15,11.2 21.95,11.2 21.46,10.71 21.46,10.28 COMPARATOR8.7 | COMPARATOR8.7 21.34,9.74 21.03,9.43 20.69,9.43 R24.2 | COMPARATOR8.7 21.46,10.05 21.46,9.62 21.65,9.43 22.13,9.43 TIMINGRES3.2
N$33
  Top 0.152: COMPARATOR8.3 22.11,7.05 22.11,6.62 22.32,6.4 23.01,6.4 23.92,7.3 TIMINGRES3.1 23.93,7.2 24.19,7.2 24.3,7.32 24.54,7.32 24.84,7.62 TIMINGCAP3.1
N$34
  Top 0.152: C23.1 R21.2 R20.1 28.8,7.47 29.08,7.19 31.59,7.19 31.78,7.38 31.78,7.91 COMPARATOR9.3
N$35
  Top 0.152: R23.2 R24.1 19.34,7 R22.2 19.65,7.02 20.27,6.4 20.88,6.4 20.9,6.43 21.03,6.43 21.22,6.62 21.22,7.05 COMPARATOR8.2
N$36
  Top 0.152: R17.1 C20.2 | C20.2 22.86,16.91 TIA3.4 | C20.2 23.02,18.89 23.47,18.44 27.01,18.44 PD3.3
N$37
  Top 0.152: F10.1 24.54,17.25 TIA3.5
N$38
  Top 0.152: F11.2 21.01,16.76 TIA3.2
N$39
  Top 0.152: F12.1 25.41,13.26 COMPARATOR7.1
N$40
  Top 0.152: C33.1 25.9,6.09 U$1.2
N$41  (via drill 0.35)
  Top 0.152: DAC.7 31.31,15.48 v31.24,15.54 | v19.2,2.13 19.2,5.29 U$2.4
  Bottom 0.152: v31.24,15.54 32.49,14.3 33.16,14.3 33.5,13.96 33.5,13.47 33.16,13.13 31.79,13.13 31.03,12.37 31.03,11.15 31.24,10.94 32.59,9.23 32.59,6.12 | 32.61,6.1 32.59,6.12 | 32.59,6.12 32.02,5.56 29.61,5.56 29.04,4.98 29.04,2.06 28.78,1.8 26.24,1.8 | 26.24,1.8 26.21,1.83 | 26.24,1.8 23.56,1.8 23.29,2.38 22.95,2.71 22.47,2.71 22.13,2.38 22.13,1.86 21.67,1.4 19.94,1.4 v19.2,2.13
SIGOUTA  (1 unrouted)
  Top 0.152: U$2.5 20.28,2.15 19.36,1.22 5.64,1.22 4.88,1.98 4.88,2.29 6.71,4.12 6.71,4.72 6.77,4.79 7.95,4.79 8.72,5.56 8.72,6.18 COMPARATOR2.7 8.69,6.45 8.69,6.86 8.56,6.86 8.49,6.93 8.46,6.93 8.23,7.16 6.63,7.16 6.62,7.18 R6.1
SIGOUTB  (via drill 0.3, 0.35)
  Top 0.152: R14.1 14.78,7.47 v15.39,6.86 | COMPARATOR6.7 13.94,3.54 14,3.54 14.26,3.8 v14.94,3.8 | U$2.6 21.28,4.93 21.64,4.57 22.55,4.57 v23.16,3.96
  Bottom 0.152: v23.16,3.96 23.16,6.25 21.95,7.47 21.34,7.47 19.66,9.14 18.75,9.14 17.68,8.08 17.31,8.08 16.46,7.24 15.82,7.24 15.75,7.17 | 15.75,7.17 15.41,6.82 | v14.94,3.8 15.59,4.46 15.59,5.69 15.39,5.89 v15.39,6.86 15.44,6.86 15.75,7.17
SIGOUTC  (via drill 0.3)
  Top 0.152: 31.36,11.31 COMPARATOR9.7 31.25,11.77 v31.61,12.13 | R22.1 19.36,6.4 19.51,6.25 19.81,6.25 19.96,6.1 22.1,6.1 22.25,5.94 22.25,5.4 U$2.7 22.83,5.37 23.62,4.57 23.62,4.36 23.77,4.21 23.77,3.2 v22.71,2.13
  Bottom 0.152: v22.71,2.13 23.01,1.5 28.93,1.5 29.41,1.98 29.41,4.21 29.34,4.29 29.34,4.86 29.74,5.25 32.27,5.25 33.43,6.42 33.43,11.38 32.77,12.04 31.7,12.04 v31.61,12.13
VO_SHEET2  (via drill 0.3, 0.35)
  Top 0.152: L2.2 C5.1 4.89,12.49 5.03,12.34 5.43,12.34 6.09,11.69 7.25,11.69 7.85,12.29 7.85,14.68 6.74,15.48 6.74,16.51 C3.1 | C22.1 33.84,17.2 L15.1 33.84,15.25 33.83,15.24 | F5.2 15.68,16.75 C17.1 | F1.2 6.84,16.6 C3.1 | F10.2 25.28,16.6 C27.1 25.29,15.59 | C36.1 27.59,7.05 U$1.8 28.85,5.79 R31.1 30.01,4.58 v30.02,4.57 32.16,4.57 33.83,6.25 33.83,15.24 | 14.39,13.56 C14.1 | 14.39,13.56 F7.2 | C17.1 15.69,14.79 16,14.48 16.92,14.48 17.37,14.02 17.3,13.95 17.3,11.72 16.7,11.12 15.35,11.12 14.4,12.06 14.4,13.55 14.39,13.56 | 23.85,13.26 F12.2 | 23.85,13.26 C24.1 | 25.29,15.59 25.29,14.79 25.85,14.23 26.16,14.23 26.59,13.8 26.59,11.41 25.99,10.81 24.64,10.81 23.7,11.76 23.7,12.32 23.85,12.47 23.85,13.26 | 33.83,15.24 33.07,14.48 28.8,14.48 28.19,15.09 25.79,15.09 25.29,15.59 | 6.74,16.61 6.74,16.87 6.85,16.98 | v7.01,17.83 7.01,17.14 6.85,16.98 | C3.1 6.85,16.98 | v15.77,17.68 15.77,17.21 15.58,17.03 15.58,16.76 C17.1 | U$2.2 17.28,2.53 v17.37,2.44
  Bottom 0.152: v30.02,4.57 30.02,1.68 29.44,1.09 16.75,1.09 | 16.75,1.09 4.55,1.09 1.09,4.55 1.09,11.91 2.74,13.56 4.27,13.56 5.59,12.24 5.59,12.19 6.86,12.19 7.16,12.5 7.16,17.68 v7.01,17.83 8.08,17.83 8.69,17.22 9.24,17.22 14.8,11.66 15.37,11.66 15.77,12.06 v15.77,17.68 | v17.37,2.44 17.37,1.72 16.75,1.09
  pour Route3: 1.98,21.34 1.68,21.34 1.68,0.76 33.68,0.76 33.68,21.18 1.98,21.18
VOUTA  (via drill 0.3)
  Top 0.152: COMPARATOR1.3 5.87,12.87 v5.79,12.95 | 29.57,17.1 v29.57,17.83 | 29.57,17.1 29.57,17.03 29.58,17.01 | DAC.1 29.62,17.05 29.57,17.1
  Bottom 0.152: v29.57,17.83 29.72,17.98 29.72,20.66 29.73,20.68 29.72,20.79 29.72,21.49 29.41,21.79 4.72,21.79 4.42,21.49 4.42,20.73 5.79,19.36 v5.79,12.95
VOUTB  (via drill 0.3)
  Top 0.152: COMPARATOR4.3 15.13,12.3 v15.09,12.34 | DAC.2 28.79,16.48 v28.35,16.92
  Bottom 0.152: v15.09,12.34 15.09,19.05 17.4,19.05 17.87,19.67 18.14,19.7 19,19.05 26.39,19.05 26.86,19.67 27.13,19.7 28,19.05 28.04,19.05 28.18,18.91 28.23,18.87 28.23,18.86 28.35,18.75 v28.35,16.92
VOUTC  (via drill 0.3)
  Top 0.152: COMPARATOR7.3 24.43,11.99 v24.38,12.04 | v26.82,16 26.82,15.85 27.19,15.48 DAC.4
  Bottom 0.152: v26.82,16 25.6,14.78 25.32,14.78 24.38,13.84 v24.38,12.04